# EAGLE schematic Hive 0.99 (EAGLE 9.6.2)
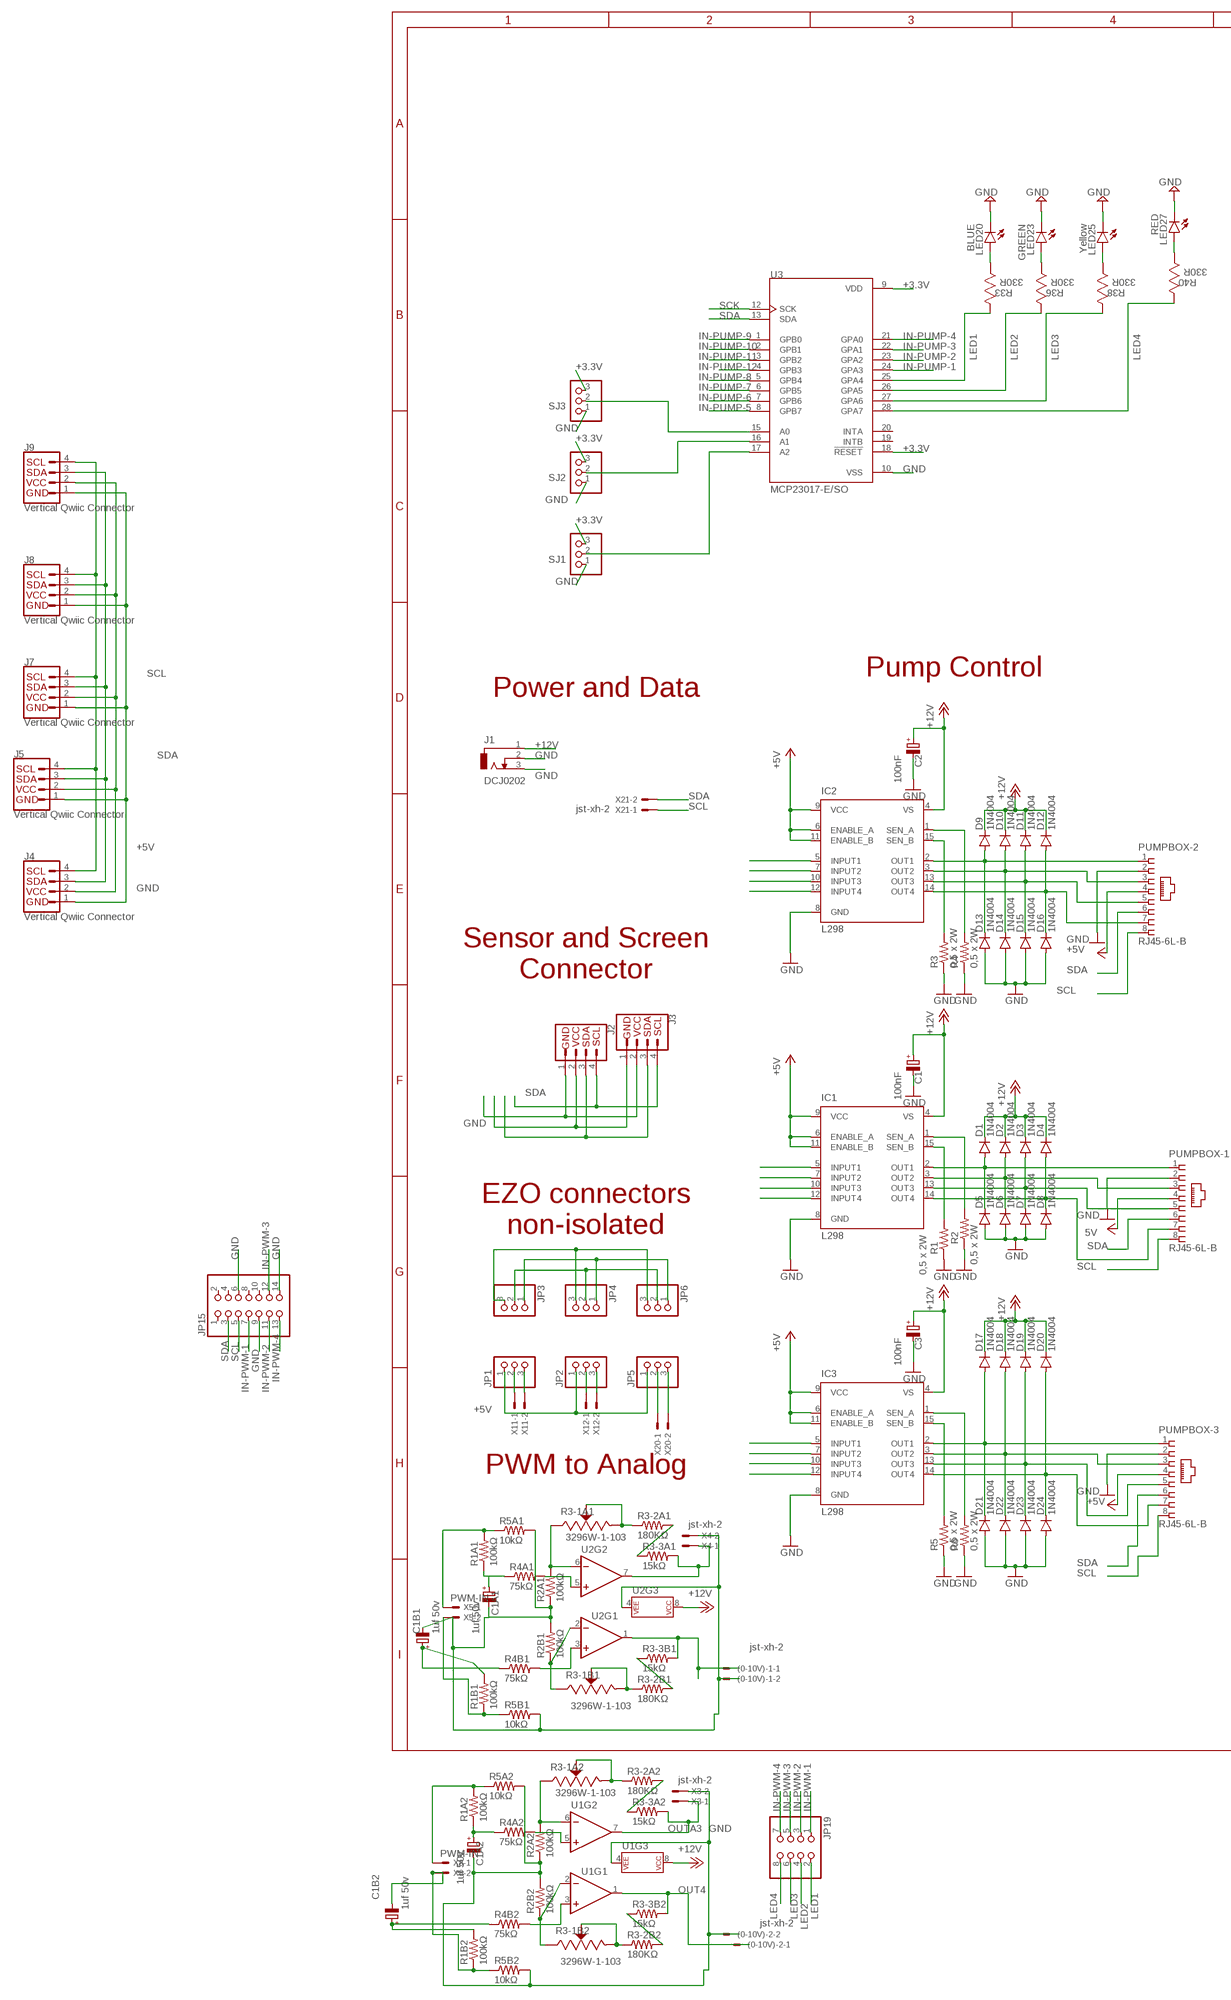
[diagram p0: schematic, sheet 1, part 1 of 2]
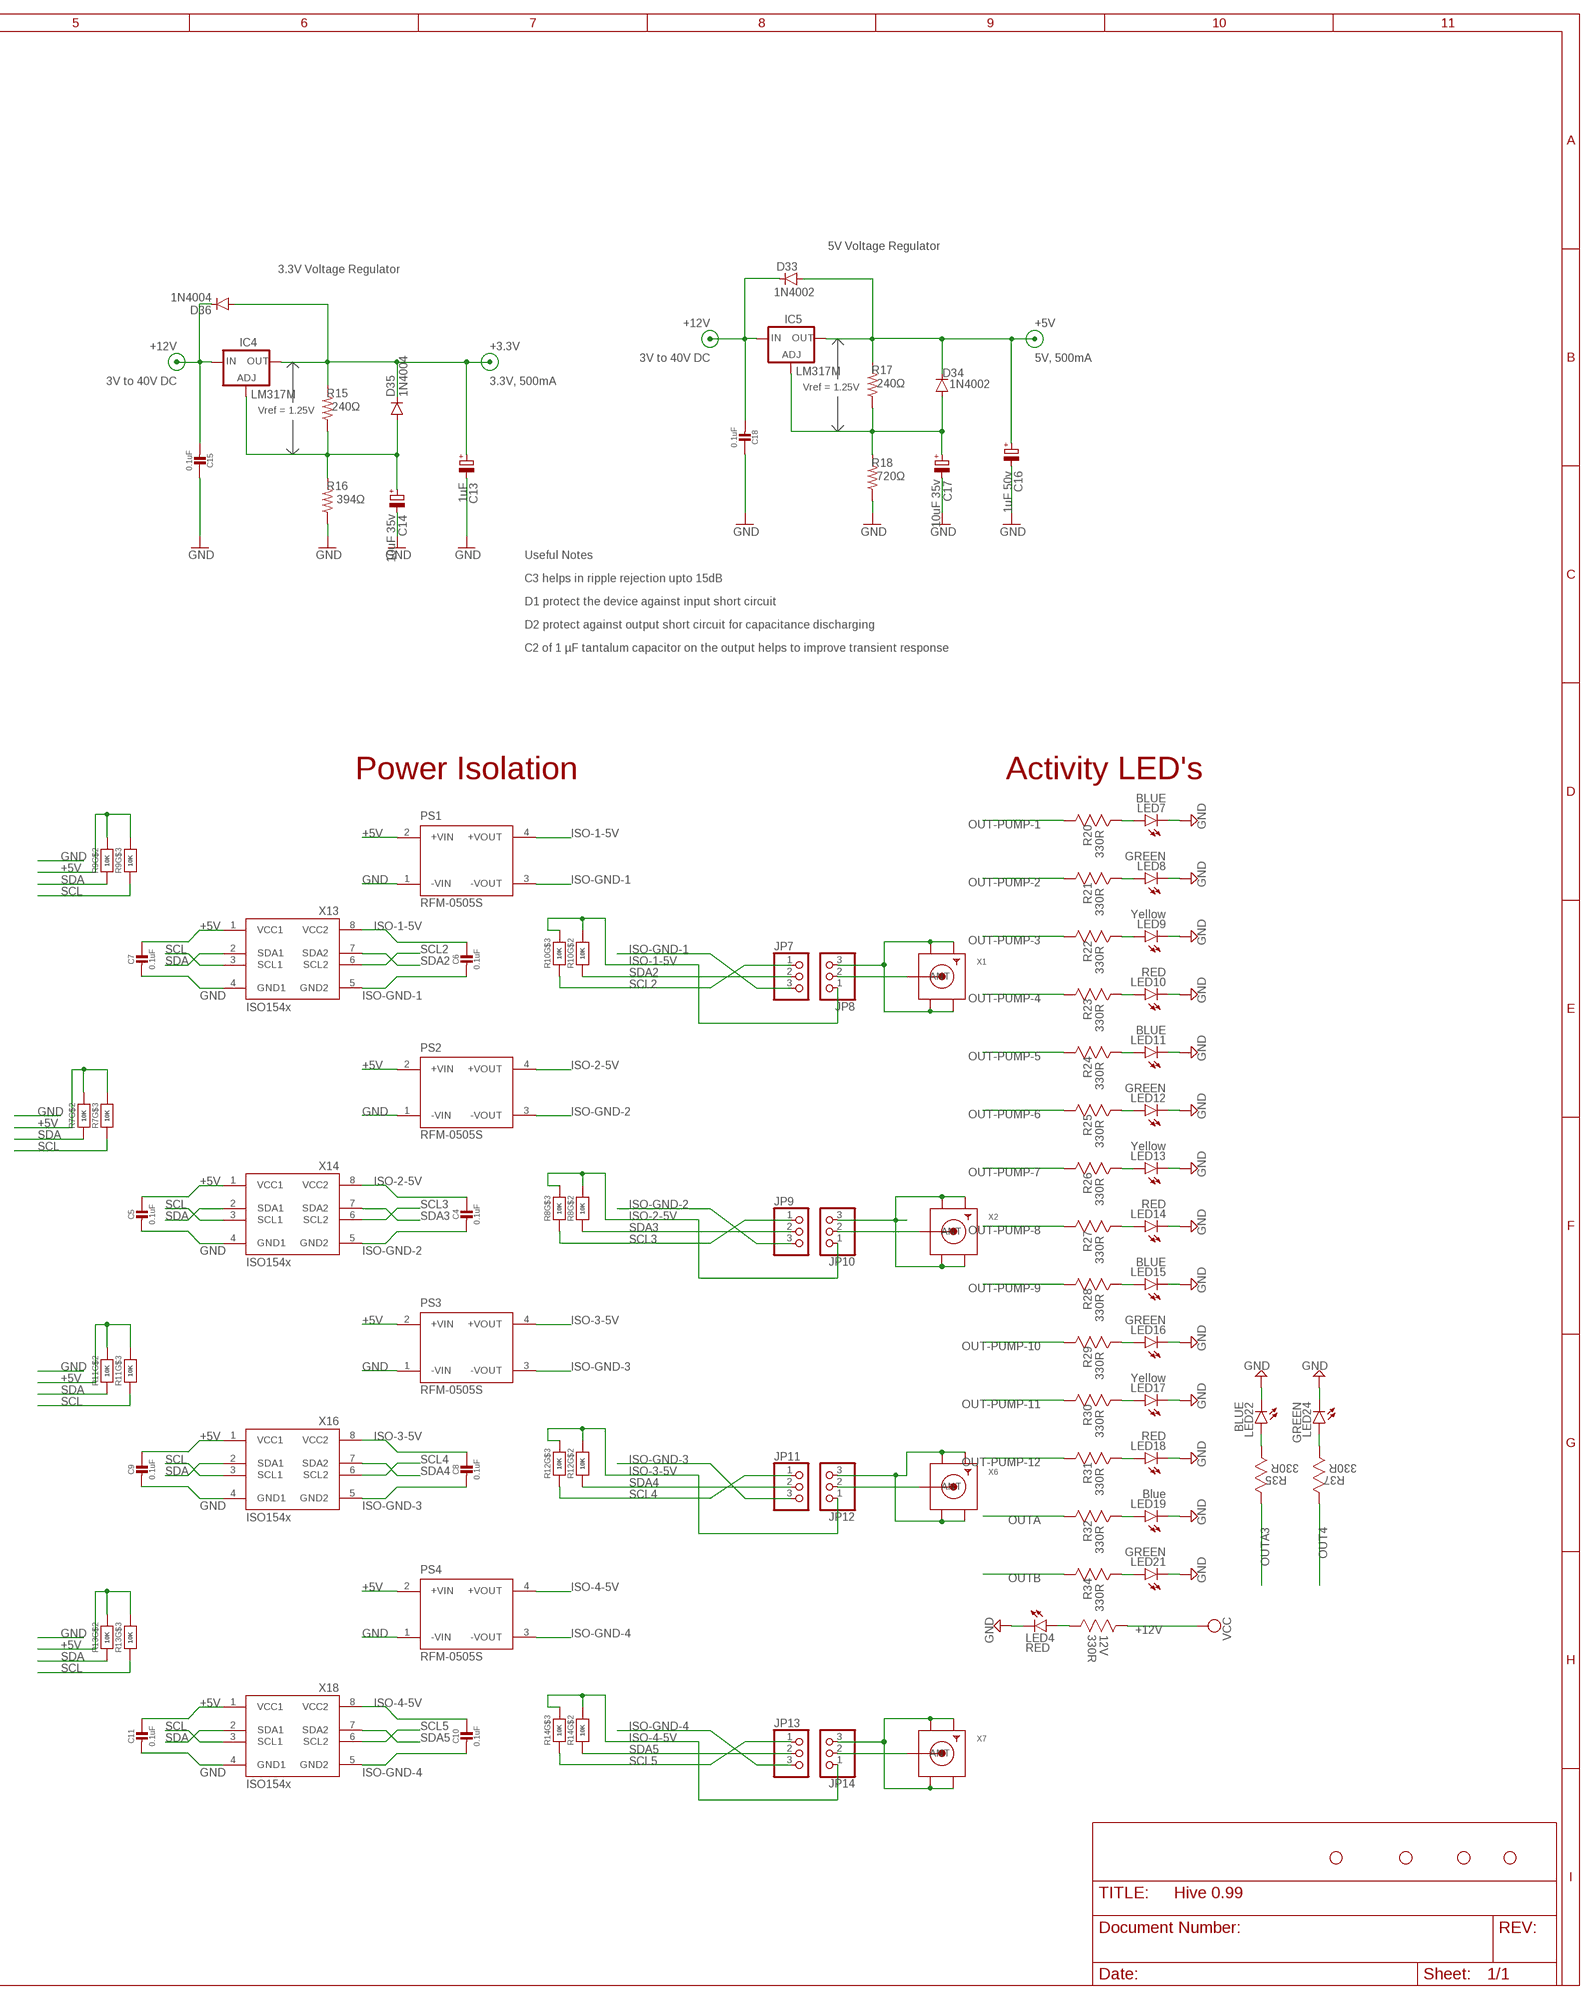
[diagram p1: schematic, sheet 1, part 2 of 2]

## Parts
12V  330R  MC0.063W06031%330R  [RESC1608X60N]
(0-10V)-1  jst-xh-2  JST-XH-02-PIN-LONG-PAD  [JST-XH-02-PACKAGE-LONG-PAD]
(0-10V)-2  jst-xh-2  JST-XH-02-PIN-LONG-PAD  [JST-XH-02-PACKAGE-LONG-PAD]
C1  100nF  1U/50V  [E1,5-4]
C1A1  1uf 50v  1U/50V  [E1,5-4]
C1A2  1uf 50v  1U/50V  [E1,5-4]
C1B1  1uf 50v  1U/50V  [E1,5-4]
C1B2  1uf 50v  1U/50V  [E1,5-4]
C2  100nF  1U/50V  [E1,5-4]
C3  100nF  1U/50V  [E1,5-4]
C4  0.1uF  CAP_CERAMIC0603_NO  [0603-NO]
C5  0.1uF  CAP_CERAMIC0603_NO  [0603-NO]
C6  0.1uF  CAP_CERAMIC0603_NO  [0603-NO]
C7  0.1uF  CAP_CERAMIC0603_NO  [0603-NO]
C8  0.1uF  CAP_CERAMIC0603_NO  [0603-NO]
C9  0.1uF  CAP_CERAMIC0603_NO  [0603-NO]
C10  0.1uF  CAP_CERAMIC0603_NO  [0603-NO]
C11  0.1uF  CAP_CERAMIC0603_NO  [0603-NO]
C13  1uF  1U/50V  [E1,5-4]
C14  10uF 35v  1U/50V  [E1,5-4]
C15  0.1uF  CAP_CERAMIC0603_NO  [0603-NO]
C16  1uF 50v  1U/50V  [E1,5-4]
C17  10uF 35v  1U/50V  [E1,5-4]
C18  0.1uF  CAP_CERAMIC0603_NO  [0603-NO]
D1  1N4004  DIODE-DO214BA  [DO214BA]
D2  1N4004  DIODE-DO214BA  [DO214BA]
D3  1N4004  DIODE-DO214BA  [DO214BA]
D4  1N4004  DIODE-DO214BA  [DO214BA]
D5  1N4004  DIODE-DO214BA  [DO214BA]
D6  1N4004  DIODE-DO214BA  [DO214BA]
D7  1N4004  DIODE-DO214BA  [DO214BA]
D8  1N4004  DIODE-DO214BA  [DO214BA]
D9  1N4004  DIODE-DO214BA  [DO214BA]
D10  1N4004  DIODE-DO214BA  [DO214BA]
D11  1N4004  DIODE-DO214BA  [DO214BA]
D12  1N4004  DIODE-DO214BA  [DO214BA]
D13  1N4004  DIODE-DO214BA  [DO214BA]
D14  1N4004  DIODE-DO214BA  [DO214BA]
D15  1N4004  DIODE-DO214BA  [DO214BA]
D16  1N4004  DIODE-DO214BA  [DO214BA]
D17  1N4004  DIODE-DO214BA  [DO214BA]
D18  1N4004  DIODE-DO214BA  [DO214BA]
D19  1N4004  DIODE-DO214BA  [DO214BA]
D20  1N4004  DIODE-DO214BA  [DO214BA]
D21  1N4004  DIODE-DO214BA  [DO214BA]
D22  1N4004  DIODE-DO214BA  [DO214BA]
D23  1N4004  DIODE-DO214BA  [DO214BA]
D24  1N4004  DIODE-DO214BA  [DO214BA]
D33  1N4002  DIODE-DO214BA  [DO214BA]
D34  1N4002  DIODE-DO214BA  [DO214BA]
D35  1N4004  DIODE-DO214BA  [DO214BA]
D36  1N4004  DIODE-DO214BA  [DO214BA]
H5  STAND-OFF  [STAND-OFF]
H6  STAND-OFF  [STAND-OFF]
H7  STAND-OFF  [STAND-OFF]
H8  STAND-OFF  [STAND-OFF]
IC1  L298  [MULTIWATT-15]
IC2  L298  [MULTIWATT-15]
IC3  L298  [MULTIWATT-15]
IC4  LM317MBSTT3  [SOT223]
IC5  LM317MBSTT3  [SOT223]
J1  DCJ0202  [DCJ0202]
J2  I2C_STANDARD  [1X04]
J3  I2C_STANDARD  [1X04]
J4  Vertical Qwiic Connector  QWIIC_CONNECTOR  [JST04_1MM_VERT]
J5  Vertical Qwiic Connector  QWIIC_CONNECTOR  [JST04_1MM_VERT]
J7  Vertical Qwiic Connector  QWIIC_CONNECTOR  [JST04_1MM_VERT]
J8  Vertical Qwiic Connector  QWIIC_CONNECTOR  [JST04_1MM_VERT]
J9  Vertical Qwiic Connector  QWIIC_CONNECTOR  [JST04_1MM_VERT]
JP1  PINHD-1X3CB  [1X03-CLEANBIG]
JP2  PINHD-1X3CB  [1X03-CLEANBIG]
JP3  PINHD-1X3CB  [1X03-CLEANBIG]
JP4  PINHD-1X3CB  [1X03-CLEANBIG]
JP5  PINHD-1X3CB  [1X03-CLEANBIG]
JP6  PINHD-1X3CB  [1X03-CLEANBIG]
JP7  PINHD-1X3CB  [1X03-CLEANBIG]
JP8  PINHD-1X3CB  [1X03-CLEANBIG]
JP9  PINHD-1X3CB  [1X03-CLEANBIG]
JP10  PINHD-1X3CB  [1X03-CLEANBIG]
JP11  PINHD-1X3CB  [1X03-CLEANBIG]
JP12  PINHD-1X3CB  [1X03-CLEANBIG]
JP13  PINHD-1X3CB  [1X03-CLEANBIG]
JP14  PINHD-1X3CB  [1X03-CLEANBIG]
JP15  PINHD-2X7  [2X07]
JP19  PINHD-2X4  [2X04]
LED4  RED  LED-RED1206  [LED-1206]
LED7  BLUE  LED-BLUE0603  [LED-0603]
LED8  GREEN  LED-GREEN0603  [LED-0603]
LED9  Yellow  LED-YELLOW-0603-WE  [LED-0603]
LED10  RED  LED-RED0603  [LED-0603]
LED11  BLUE  LED-BLUE0603  [LED-0603]
LED12  GREEN  LED-GREEN0603  [LED-0603]
LED13  Yellow  LED-YELLOW0603  [LED-0603]
LED14  RED  LED-RED0603  [LED-0603]
LED15  BLUE  LED-BLUE0603  [LED-0603]
LED16  GREEN  LED-GREEN0603  [LED-0603]
LED17  Yellow  LED-YELLOW0603  [LED-0603]
LED18  RED  LED-RED0603  [LED-0603]
LED19  Blue  LED-BLUE-0603-WE  [LED-0603]
LED20  BLUE  LED-BLUE0603  [LED-0603]
LED21  GREEN  LED-GREEN0603  [LED-0603]
LED22  BLUE  LED-BLUE0603  [LED-0603]
LED23  GREEN  LED-GREEN0603  [LED-0603]
LED24  GREEN  LED-GREEN0603  [LED-0603]
LED25  Yellow  LED-YELLOW0603  [LED-0603]
LED27  RED  LED-RED0603  [LED-0603]
PS1  RFM-0505S  [CONV_RFM-0505S]
PS2  RFM-0505S  [CONV_RFM-0505S]
PS3  RFM-0505S  [CONV_RFM-0505S]
PS4  RFM-0505S  [CONV_RFM-0505S]
PUMPBOX-1  RJ45-6L-B  [RJ45-NO-SHIELD]
PUMPBOX-2  RJ45-6L-B  [RJ45-NO-SHIELD]
PUMPBOX-3  RJ45-6L-B  [RJ45-NO-SHIELD]
R1  0,5 x 2W  R-US_R2512  [R2512]
R1A1  100kΩ  R-US_M1206  [M1206]
R1A2  100kΩ  R-US_M1206  [M1206]
R1B1  100kΩ  R-US_M1206  [M1206]
R1B2  100kΩ  R-US_M1206  [M1206]
R2  0,5 x 2W  R-US_R2512  [R2512]
R2A1  100kΩ  R-US_M1206  [M1206]
R2A2  100kΩ  R-US_M1206  [M1206]
R2B1  100kΩ  R-US_M1206  [M1206]
R2B2  100kΩ  R-US_M1206  [M1206]
R3  0,5 x 2W  R-US_R2512  [R2512]
R3-1A1  3296W-1-103  [TRIM_3296W-1-103]
R3-1A2  3296W-1-103  [TRIM_3296W-1-103]
R3-1B1  3296W-1-103  [TRIM_3296W-1-103]
R3-1B2  3296W-1-103  [TRIM_3296W-1-103]
R3-2A1  180KΩ  R-US_M1206  [M1206]
R3-2A2  180KΩ  R-US_M1206  [M1206]
R3-2B1  180KΩ  R-US_M1206  [M1206]
R3-2B2  180KΩ  R-US_M1206  [M1206]
R3-3A1  15kΩ  R-US_M1206  [M1206]
R3-3A2  15kΩ  R-US_M1206  [M1206]
R3-3B1  15kΩ  R-US_M1206  [M1206]
R3-3B2  15kΩ  R-US_M1206  [M1206]
R4  0,5 x 2W  R-US_R2512  [R2512]
R4A1  75kΩ  R-US_M1206  [M1206]
R4A2  75kΩ  R-US_M1206  [M1206]
R4B1  75kΩ  R-US_M1206  [M1206]
R4B2  75kΩ  R-US_M1206  [M1206]
R5  0,5 x 2W  R-US_R2512  [R2512]
R5A1  10kΩ  R-US_M1206  [M1206]
R5A2  10kΩ  R-US_M1206  [M1206]
R5B1  10kΩ  R-US_M1206  [M1206]
R5B2  10kΩ  R-US_M1206  [M1206]
R6  0,5 x 2W  R-US_R2512  [R2512]
R7  10K  RESISTOR_4PACK  [RESPACK_4X0603]
R8  10K  RESISTOR_4PACK  [RESPACK_4X0603]
R9  10K  RESISTOR_4PACK  [RESPACK_4X0603]
R10  10K  RESISTOR_4PACK  [RESPACK_4X0603]
R11  10K  RESISTOR_4PACK  [RESPACK_4X0603]
R12  10K  RESISTOR_4PACK  [RESPACK_4X0603]
R13  10K  RESISTOR_4PACK  [RESPACK_4X0603]
R14  10K  RESISTOR_4PACK  [RESPACK_4X0603]
R15  240Ω  R-US_M0805  [M0805]
R16  394Ω  R-US_M0805  [M0805]
R17  240Ω  R-US_M0805  [M0805]
R18  720Ω  R-US_M0805  [M0805]
R20  330R  MC0.063W06031%330R  [RESC1608X60N]
R21  330R  MC0.063W06031%330R  [RESC1608X60N]
R22  330R  MC0.063W06031%330R  [RESC1608X60N]
R23  330R  MC0.063W06031%330R  [RESC1608X60N]
R24  330R  MC0.063W06031%330R  [RESC1608X60N]
R25  330R  MC0.063W06031%330R  [RESC1608X60N]
R26  330R  MC0.063W06031%330R  [RESC1608X60N]
R27  330R  MC0.063W06031%330R  [RESC1608X60N]
R28  330R  MC0.063W06031%330R  [RESC1608X60N]
R29  330R  MC0.063W06031%330R  [RESC1608X60N]
R30  330R  MC0.063W06031%330R  [RESC1608X60N]
R31  330R  MC0.063W06031%330R  [RESC1608X60N]
R32  330R  MC0.063W06031%330R  [RESC1608X60N]
R33  330R  MC0.063W06031%330R  [RESC1608X60N]
R34  330R  MC0.063W06031%330R  [RESC1608X60N]
R35  330R  MC0.063W06031%330R  [RESC1608X60N]
R36  330R  MC0.063W06031%330R  [RESC1608X60N]
R37  330R  MC0.063W06031%330R  [RESC1608X60N]
R38  330R  MC0.063W06031%330R  [RESC1608X60N]
R40  330R  MC0.063W06031%330R  [RESC1608X60N]
SJ1  PINHD-1X3  [1X03]
SJ2  PINHD-1X3  [1X03]
SJ3  PINHD-1X3  [1X03]
U1  LM358  LM358SOI8  [SO08]
U2  LM358  LM358SOI8  [SO08]
U3  MCP23017-E/SO  [SOIC127P1030X265-28N]
X1  SMACONNECTOR_EDGE  [SMA_EDGELAUNCH]
X2  SMACONNECTOR_EDGE  [SMA_EDGELAUNCH]
X3  jst-xh-2  JST-XH-02-PIN-LONG-PAD  [JST-XH-02-PACKAGE-LONG-PAD]
X4  jst-xh-2  JST-XH-02-PIN-LONG-PAD  [JST-XH-02-PACKAGE-LONG-PAD]
X5  PWM-IN  JST-XH-02-PIN-LONG-PAD  [JST-XH-02-PACKAGE-LONG-PAD]
X6  SMACONNECTOR_EDGE  [SMA_EDGELAUNCH]
X7  SMACONNECTOR_EDGE  [SMA_EDGELAUNCH]
X8  PWM-IN  JST-XH-02-PIN-LONG-PAD  [JST-XH-02-PACKAGE-LONG-PAD]
X11  jst-xh-2  JST-XH-02-PIN-LONG-PAD  [JST-XH-02-PACKAGE-LONG-PAD]
X12  jst-xh-2  JST-XH-02-PIN-LONG-PAD  [JST-XH-02-PACKAGE-LONG-PAD]
X13  ISO154X  [SOIC8_150MIL]
X14  ISO154X  [SOIC8_150MIL]
X16  ISO154X  [SOIC8_150MIL]
X18  ISO154X  [SOIC8_150MIL]
X20  jst-xh-2  JST-XH-02-PIN-LONG-PAD  [JST-XH-02-PACKAGE-LONG-PAD]
X21  jst-xh-2  JST-XH-02-PIN-LONG-PAD  [JST-XH-02-PACKAGE-LONG-PAD]

## Nets
+3.3V [3.3v]: C13.+ D35.C D36.A IC4.4(OUT) R15.2 SJ1.3 SJ2.3 SJ3.3 U3.9(VDD) U3.18(!RESET)
+5V [5v]: C5.1 C7.1 C9.1 C11.1 C16.+ D33.A D34.C IC1.6(ENABLE_A) IC1.9(VCC) IC1.11(ENABLE_B) IC2.6(ENABLE_A) IC2.9(VCC) IC2.11(ENABLE_B) IC3.6(ENABLE_A) IC3.9(VCC) IC3.11(ENABLE_B) IC5.4(OUT) J2.1 J3.2 J4.2 J5.2 J7.2 J8.2 J9.2 JP1.1 JP2.1 JP5.1 PS1.2(+VIN) PS2.2(+VIN) PS3.2(+VIN) PS4.2(+VIN) PUMPBOX-1.4 PUMPBOX-2.4 PUMPBOX-3.4 R7.6 R7.7 R9.6 R9.7 R11.6 R11.7 R13.6 R13.7 R17.2 X13.1(VCC1) X14.1(VCC1) X16.1(VCC1) X18.1(VCC1) ; supply symbol labelled +3V3
+12V [12v]: 12V.1(R1) C1.+ C2.+ C3.+ C15.2 C18.2 D1.C D2.C D3.C D4.C D9.C D10.C D11.C D12.C D17.C D18.C D19.C D20.C D33.C D36.C IC1.4(VS) IC2.4(VS) IC3.4(VS) IC4.3(IN) IC5.3(IN) J1.1 U1.8(P$V+) U2.8(P$V+) ; supply symbol labelled VCC
GND: (0-10V)-1.2 (0-10V)-2.2 C1.- C1A1.- C1A2.- C1B1.- C2.- C3.- C5.2 C7.2 C9.2 C11.2 C13.- C14.- C15.1 C16.- C17.- C18.1 D5.A D6.A D7.A D8.A D13.A D14.A D15.A D16.A D21.A D22.A D23.A D24.A IC1.8(GND) IC2.8(GND) IC3.8(GND) J1.2 J1.3 J2.2 J3.1 J4.1 J5.1 J7.1 J8.1 J9.1 JP3.3 JP4.3 JP6.3 JP15.6 JP15.9 JP15.14 LED4.C LED7.C LED8.C LED9.C LED10.C LED11.C LED12.C LED13.C LED14.C LED15.C LED16.C LED17.C LED18.C LED19.C LED20.C LED21.C LED22.C LED23.C LED24.C LED25.C LED27.C PS1.1(-VIN) PS2.1(-VIN) PS3.1(-VIN) PS4.1(-VIN) PUMPBOX-1.2 PUMPBOX-2.2 PUMPBOX-3.2 R1.1 R2.1 R2A1.1 R2A2.1 R2B1.2 R2B2.2 R3.1 R4.1 R5.1 R5A1.2 R5A2.2 R5B1.2 R5B2.2 R6.1 R16.1 R18.1 SJ1.1 SJ2.1 SJ3.1 U1.4(P$V-) U2.4(P$V-) U3.10(VSS) X3.2 X4.2 X13.4(GND1) X14.4(GND1) X16.4(GND1) X18.4(GND1)
IN-PUMP-1: IC1.5(INPUT1) U3.24(GPA3)
IN-PUMP-2: IC1.7(INPUT2) U3.23(GPA2)
IN-PUMP-3: IC1.10(INPUT3) U3.22(GPA1)
IN-PUMP-4: IC1.12(INPUT4) U3.21(GPA0)
IN-PUMP-5 [GPIO]: IC2.5(INPUT1) U3.8(GPB7)
IN-PUMP-6 [GPIO]: IC2.7(INPUT2) U3.7(GPB6)
IN-PUMP-7 [GPIO]: IC2.10(INPUT3) U3.6(GPB5)
IN-PUMP-8 [GPIO]: IC2.12(INPUT4) U3.5(GPB4)
IN-PUMP-9 [GPIO]: IC3.5(INPUT1) U3.1(GPB0)
IN-PUMP-10 [GPIO]: IC3.7(INPUT2) U3.2(GPB1)
IN-PUMP-11 [GPIO]: IC3.10(INPUT3) U3.3(GPB2)
IN-PUMP-12 [GPIO]: IC3.12(INPUT4) U3.4(GPB3)
IN-PWM-1: JP15.7 JP19.1 R1A1.2 R5A1.1 X5.1
IN-PWM-2: JP15.11 JP19.3 R1B1.1 R5B1.1 X5.2
IN-PWM-3: JP15.12 JP19.5 R1A2.2 R5A2.1 X8.1
IN-PWM-4: C1B2.- JP15.13 JP19.7 R1B2.1 R5B2.1 X8.2
ISO-1-5V: C6.1 JP8.1 PS1.4(+VOUT) R10.6 R10.7 X13.8(VCC2)
ISO-2-5V: C4.1 JP10.1 PS2.4(+VOUT) R8.6 R8.7 X14.8(VCC2)
ISO-3-5V: C8.1 JP12.1 PS3.4(+VOUT) R12.6 R12.7 X16.8(VCC2)
ISO-4-5V: C10.1 JP14.1 PS4.4(+VOUT) R14.6 R14.7 X18.8(VCC2)
ISO-GND-1: C6.2 JP7.3 PS1.3(-VOUT) X13.5(GND2)
ISO-GND-2: C4.2 JP9.3 PS2.3(-VOUT) X14.5(GND2)
ISO-GND-3: C8.2 JP11.3 PS3.3(-VOUT) X16.5(GND2)
ISO-GND-4: C10.2 JP13.3 PS4.3(-VOUT) X18.5(GND2)
LED1: JP19.2 R33.1(R1) U3.25(GPA4)
LED2: JP19.4 R36.1(R1) U3.26(GPA5)
LED3: JP19.6 R38.1(R1) U3.27(GPA6)
LED4: JP19.8 R40.1(R1) U3.28(GPA7)
N$1: IC2.1(SEN_A) R4.2
N$2: IC2.15(SEN_B) R3.2
N$3: IC3.1(SEN_A) R6.2
N$4: IC3.15(SEN_B) R5.2
N$5: C14.+ D35.A IC4.1(ADJ) R15.1 R16.2
N$6: R3-1B2.2(WIPER) R3-1B2.3(CW) R3-2B2.1
N$7: LED20.A R33.2(R2)
N$8: R3-2B2.2 R3-3B2.1
N$9: IC1.1(SEN_A) R2.2
N$10: IC1.15(SEN_B) R1.2
N$11: C17.+ D34.A IC5.1(ADJ) R17.1 R18.2
N$12: JP12.3 X6.GND@1(GND4) X6.GND@2(GND3) X6.GND@3(GND2) X6.GND@4(GND1)
N$13: LED23.A R36.2(R2)
N$14: JP8.3 X1.GND@1(GND4) X1.GND@2(GND3) X1.GND@3(GND2) X1.GND@4(GND1)
N$15: JP10.3 X2.GND@1(GND4) X2.GND@2(GND3) X2.GND@3(GND2) X2.GND@4(GND1)
N$16: JP8.2 X1.P(ANT)
N$17: R3-1B1.2(WIPER) R3-1B1.3(CW) R3-2B1.1
N$18: R3-2B1.2 R3-3B1.1
N$19: R3-1A1.2(WIPER) R3-1A1.3(CW) R3-2A1.1
N$20: R3-2A1.2 R3-3A1.1
N$21: C1A1.+ R1A1.1 R4A1.1
N$22: C1B1.+ R1B1.2 R4B1.1
N$23: R2A1.2 R3-1A1.1(CCW) U2.6(-IN)
N$24: R2B1.1 R3-1B1.1(CCW) U2.2(-IN)
N$25: R4A1.2 U2.5(+IN)
N$26: R4B1.2 U2.3(+IN)
N$27: C1B2.+ R1B2.2 R4B2.1
N$28: LED22.A R35.2(R2)
N$29: LED24.A R37.2(R2)
N$30: JP14.3 X7.GND@1(GND4) X7.GND@2(GND3) X7.GND@3(GND2) X7.GND@4(GND1)
N$31: JP5.2 X20.1
N$32: JP10.2 X2.P(ANT)
N$33: JP5.3 X20.2
N$34: JP2.2 X12.1
N$35: JP2.3 X12.2
N$36: JP12.2 X6.P(ANT)
N$37: JP1.2 X11.1
N$38: JP1.3 X11.2
N$40: JP14.2 X7.P(ANT)
N$47: 12V.2(R2) LED4.A
N$50 [GPIO]: LED7.A R20.2(R2)
N$51 [GPIO]: LED8.A R21.2(R2)
N$52 [GPIO]: LED9.A R22.2(R2)
N$53 [GPIO]: LED10.A R23.2(R2)
N$54 [GPIO]: LED11.A R24.2(R2)
N$55 [GPIO]: LED12.A R25.2(R2)
N$56 [GPIO]: LED13.A R26.2(R2)
N$57 [GPIO]: LED14.A R27.2(R2)
N$58 [GPIO]: LED15.A R28.2(R2)
N$59 [GPIO]: LED16.A R29.2(R2)
N$60 [GPIO]: LED17.A R30.2(R2)
N$61 [GPIO]: LED18.A R31.2(R2)
N$62 [GPIO]: LED19.A R32.2(R2)
N$63: R3-1A2.2(WIPER) R3-1A2.3(CW) R3-2A2.1
N$64 [GPIO]: LED21.A R34.2(R2)
N$65: LED25.A R38.2(R2)
N$66: R3-2A2.2 R3-3A2.1
N$67: LED27.A R40.2(R2)
N$68: C1A2.+ R1A2.1 R4A2.1
N$70: R2A2.2 R3-1A2.1(CCW) U1.6(-IN)
N$71: R2B2.1 R3-1B2.1(CCW) U1.2(-IN)
N$72: R4A2.2 U1.5(+IN)
N$73: R4B2.2 U1.3(+IN)
N$74: SJ3.2 U3.15(A0)
N$75: SJ2.2 U3.16(A1)
N$76: SJ1.2 U3.17(A2)
OUT4: (0-10V)-2.1 R3-3B2.2 R37.1(R1) U1.1(OUT)
OUT-PUMP-1 [Pump Out]: D1.A D5.C IC1.2(OUT1) PUMPBOX-1.1 R20.1(R1)
OUT-PUMP-2 [Pump Out]: D2.A D6.C IC1.3(OUT2) PUMPBOX-1.3 R21.1(R1)
OUT-PUMP-3 [Pump Out]: D3.A D7.C IC1.13(OUT3) PUMPBOX-1.5 R22.1(R1)
OUT-PUMP-4 [Pump Out]: D4.A D8.C IC1.14(OUT4) PUMPBOX-1.7 R23.1(R1)
OUT-PUMP-5 [Pump Out]: D9.A D13.C IC2.2(OUT1) PUMPBOX-2.1 R24.1(R1)
OUT-PUMP-6 [Pump Out]: D10.A D14.C IC2.3(OUT2) PUMPBOX-2.3 R25.1(R1)
OUT-PUMP-7 [Pump Out]: D11.A D15.C IC2.13(OUT3) PUMPBOX-2.5 R26.1(R1)
OUT-PUMP-8 [Pump Out]: D12.A D16.C IC2.14(OUT4) PUMPBOX-2.7 R27.1(R1)
OUT-PUMP-9 [Pump Out]: D17.A D21.C IC3.2(OUT1) PUMPBOX-3.1 R28.1(R1)
OUT-PUMP-10 [Pump Out]: D18.A D22.C IC3.3(OUT2) PUMPBOX-3.3 R29.1(R1)
OUT-PUMP-11 [Pump Out]: D19.A D23.C IC3.13(OUT3) PUMPBOX-3.5 R30.1(R1)
OUT-PUMP-12: D20.A D24.C IC3.14(OUT4) PUMPBOX-3.7 R31.1(R1)
OUTA: R3-3A1.2 R32.1(R1) U2.7(OUT) X4.1
OUTA3: R3-3A2.2 R35.1(R1) U1.7(OUT) X3.1
OUTB: (0-10V)-1.1 R3-3B1.2 R34.1(R1) U2.1(OUT)
SCK: U3.12(SCK)
SCL: J2.3 J3.3 J4.4 J5.4 J7.4 J8.4 J9.4 JP3.1 JP4.1 JP6.1 JP15.5 PUMPBOX-1.8 PUMPBOX-2.8 PUMPBOX-3.8 R7.3 R9.3 R11.3 R13.3 X13.3(SCL1) X14.3(SCL1) X16.3(SCL1) X18.3(SCL1) X21.1
SCL2: JP7.1 R10.3 X13.6(SCL2)
SCL3: JP9.1 R8.3 X14.6(SCL2)
SCL4: JP11.1 R12.3 X16.6(SCL2)
SCL5: JP13.1 R14.3 X18.6(SCL2)
SDA: J2.4 J3.4 J4.3 J5.3 J7.3 J8.3 J9.3 JP3.2 JP4.2 JP6.2 JP15.3 PUMPBOX-1.6 PUMPBOX-2.6 PUMPBOX-3.6 R7.2 R9.2 R11.2 R13.2 U3.13(SDA) X13.2(SDA1) X14.2(SDA1) X16.2(SDA1) X18.2(SDA1) X21.2
SDA2: JP7.2 R10.2 X13.7(SDA2)
SDA3: JP9.2 R8.2 X14.7(SDA2)
SDA4: JP11.2 R12.2 X16.7(SDA2)
SDA5: JP13.2 R14.2 X18.7(SDA2)
Unconnected: JP15.1 JP15.2 JP15.4 JP15.8 JP15.10 R7.1 R7.4 R7.5 R7.8 R8.1 R8.4 R8.5 R8.8 R9.1 R9.4 R9.5 R9.8 R10.1 R10.4 R10.5 R10.8 R11.1 R11.4 R11.5 R11.8 R12.1 R12.4 R12.5 R12.8 R13.1 R13.4 R13.5 R13.8 R14.1 R14.4 R14.5 R14.8 U3.19(INTB) U3.20(INTA)

## Notes on the sheet
- 5V Voltage Regulator
- 3.3V Voltage Regulator
- 3V to 40V DC | 5V, 500mA
- 3V to 40V DC | 3.3V, 500mA
- Vref = 1.25V
- Vref = 1.25V
- Useful Notes
- C3 helps in ripple rejection upto 15dB
- D1 protect the device against input short circuit
- D2 protect against output short circuit for capacitance discharging
- C2 of 1 µF tantalum capacitor on the output helps to improve transient response
- Pump Control
- Power Isolation | Activity LED's
- Power and Data
- Sensor and Screen
  Connector
- EZO connectors
  non-isolated
- PWM to Analog

## Library data of the parts
12V R20-R38 R40 = Multicomp:MC0.063W06031%330R: RESISTOR, 0603; MPN: MC0.063W06031%330R; OC_FARNELL: 9331018; OC_NEWARK: -; SUPPLIER: Multicomp; TOLERANCE: ±1%; VALUE: 330 Ohms; WATTAGE: 1/16 W
(0-10V)-1 (0-10V)-2 X3-X5 X8 X11 X12 X20 X21 = Rembrandt Electronics - JST XH Connectors v1-0:JST-XH-02-PIN: JST XH Connector 2 Pin Wire to board connector. Pitch: 2,54 mm, (0.100") Number of pins: 2 Created by Rembrandt Electronics www.rembrandtelectronics.com
C1 C1A1 C1A2 C1B1 C1B2 C2 C3 C13 C14 C16 C17 = capacitors-electrolytic:?; MOUSER: 647-USW1H010MDD
C4-C11 C15 C18 = microbuilder:CAP_CERAMIC: Ceramic Capacitors For new designs, use the packages preceded by an '_' character since they are more reliable: The following footprints should be used on most boards: _0402 - Standard footprint for regular board layouts _0603 - Standard footprint for regular board layouts _0805 - Standard footprint for regular board layouts _1206 - Standard footprint for regular board layouts For extremely tight-pitch boards where space is at a premium, the following 'micro-pitch' footprints can be used (smaller pads, no silkscreen outline, etc.): _0402MP - Micro-pitch footprint for very dense/compact boards _0603MP - Micro-pitch footprint for very dense/compact boards _0805MP - Micro-pitch footprint for very dense/compact boards _1206MP - Micro-pitch footprint for very dense/compact boards
D1-D24 D33-D36 = diode:DIODE-: DIODE
H5-H8 = SparkFun-Hardware:STAND-OFF: Stand Off Drill holes for mechanically mounting via screws, standoffs, etc. Note: Use the keepout ring to avoid running the screw head into surrounding components. Variant Overviews STAND-OFF - Mechanical footprint for a #4 phillips button head screw. STAND-OFF-TIGHT - Mechanical footprint for a #4 phillips button head screw, Example SparkFun Products Screw - Phillips Head (1/4", 4-40, 10 pack) <https://www.sparkfun.com/products/10453> (PRT-10453) Screw - Phillips Head (1/2", 4-40, 10 pack) <https://www.sparkfun.com/products/10452> (PRT-10452) Screw - Phillips Head (3/4", 4-40, 10 pack) <https://www.sparkfun.com/products/10451> (PRT-10451) Screw - Phillips Head (1", 4-40, 10 pack) <https://www.sparkfun.com/products/10450> (PRT-10450)
IC1-IC3 = st-microelectronics:L298: DUAL FULL-BRIDGE DRIVER
IC4 IC5 = v-reg:LM317?*: 500 mA Adjustable Output Positive Voltage Regulator Source: http://www.onsemi.co.jp .. LM317M-D.PDF; PARTNUMBER: LM317M
J1 = con-jack:DCJ0202: DC POWER JACK Source: DCJ0202.pdf; OC_FARNELL: unknown; OC_NEWARK: unknown
J2 J3 = SparkFun-Connectors:I2C_STANDARD: SparkFun I2C Standard Pinout Header SparkFun has standardized on a pinout for all I2C based sensor breakouts. This pinout allows I2C boards to be plugged directly into the headers on Arduino Uno compatible boards, and to be daisy chained easily. Example SparkFun Products: SparkFun Atmospheric Sensor Breakout - BME280 <https://www.sparkfun.com/products/13676> SparkFun Altitude/Pressure Sensor Breakout - MPL3115A2 <https://www.sparkfun.com/products/11084> SparkFun TOF Range Finder Sensor - VL6180 <https://www.sparkfun.com/products/12785>
J4 J5 J7-J9 = SparkFun-Connectors:QWIIC_CONNECTOR: SparkFun I2C Standard Qwiic Connector An SMD 1mm pitch JST connector makes it easy and quick (get it? Qwiic?) to connect I2C devices to each other. The Qwiic system <http://www.sparkfun.com/qwiic> enables fast and solderless connection between popular platforms and various sensors and actuators. We carry 200mm <https://www.sparkfun.com/products/14204>, 100mm <https://www.sparkfun.com/products/14205>, 50mm <https://www.sparkfun.com/products/14206>, and breadboard friendly <https://www.sparkfun.com/products/14207> Qwiic cables. We also offer 10 pcs strips <https://www.sparkfun.com/products/14323> the SMD connectors.; PROD_ID: CONN-14483
JP1-JP14 SJ1-SJ3 = adafruit:PINHD-1X3: PIN HEADER
JP15 = pinhead:PINHD-2X7: PIN HEADER
JP19 = pinhead:PINHD-2X4: PIN HEADER
LED4 = SparkFun-LED:LED-RED: Red SMD LED Used in manufacturing of most products at SparkFun Packages: 0603 - SMD 0603 package [Product Link] <http://docs.avagotech.com/docs/AV02-0551EN> 0603 SMART - SMD 0603 SMART package ( more efficient and expensive)[Product Link] <http://www.osram-os.com/Graphics/XPic2/00077099_0.pdf> 1206 - SMD1206 package [Product Link] <https://www.sparkfun.com/datasheets/DevTools/LilyPad/Q150OVS4.pdff> SparkFun Products: Pro Mini 328 -5V <https://www.sparkfun.com/products/821> RedBoard <https://www.sparkfun.com/products/12757> IOIO-OTG <https://www.sparkfun.com/products/13613>; PROD_ID: DIO-09912
LED7 LED11 LED15 LED20 LED22 = SparkFun-LED:LED-BLUE: Blue SMD LED Used in manufacturing of various products at SparkFun Packages: 0603 - SMD 0603 package [Product Link] <http://www.digikey.com/product-detail/en/SMLE12BC7TT86/511-1589-2-ND/1641808> 1206 - SMD1206 package [Product Link] <http://www.digikey.com/product-detail/en/lite-on-inc/LTST-C150TBKT/160-1643-1-ND/573584> SparkFun Products: ESP8266 Thing-Dev Board <https://www.sparkfun.com/products/13711> RedBoard <https://www.sparkfun.com/products/12757>; PROD_ID: DIO-08575
LED8 LED12 LED16 LED21 LED23 LED24 = SparkFun-LED:LED-GREEN: Green SMD LED Used in manufacturing of various products at SparkFun Packages: 0603 - SMD 0603 package [Product Link] <http://www.futureelectronics.com/en/technologies/semiconductors/optoelectronics/leds/Pages/9894312-LTST-C190GKT.aspx?CrossPart=HSMG-C190&IM=0> LilyPad 1206 - SMD1206 LilyPad package [Product Link] <http://www.futureelectronics.com/en/Technologies/Product.aspx?ProductID=IN150NGHARVATEKCORPORATION2049943&IM=0> 1206 - SMD1206 package [Product Link] <http://www.futureelectronics.com/en/technologies/semiconductors/optoelectronics/leds/Pages/8315665-LTST-C150KGKT.aspx?IM=0> 1206 Bottom Mount -SMD 1206 Bottom Mount [Product Link] <http://www.digikey.com/product-detail/en/lite-on-inc/LTST-C230KGKT/160-1456-1-ND/386854> SparkFun Products: Pro Mini 328 -5V <https://www.sparkfun.com/products/821> RedBoard <https://www.sparkfun.com/products/12757> MP3 Trigger <https://www.sparkfun.com/products/13720> Makey Makey <https://www.sparkfun.com/products/11076>; PROD_ID: DIO-00821
LED9 = SparkFun-LED:LED-YELLOW: Yellow SMD LED Used in manufacturing several products at SparkFun. Packages: 0603 - SMD 0603 package[Product Link] <http://www.kingbrightusa.com/product.asp?catalog_name=LED&product_id=APT1608SYCK> 0603 -SMART - SMART SMD 0603 package (more efficient/more expensive) [Product Link] <http://www.osram-os.com/osram_os/en/products/product-catalog/led-light-emitting-diodes/smartled-0603/ly-l29k/index.jsp> LilyPad - SMD1206 package[Product Datasheet] <https://www.sparkfun.com/datasheets/DevTools/LilyPad/Q150YUS4.pdf> SparkFun Products: Blynk Board <https://www.sparkfun.com/products/13794> IOIO-OTG <https://www.sparkfun.com/products/13613> XBee Explorer Serial <https://www.sparkfun.com/products/13225>; PROD_ID: DIO-16514
LED10 LED14 LED18 LED27 = SparkFun-LED:LED-RED: Red SMD LED Used in manufacturing of most products at SparkFun Packages: 0603 - SMD 0603 package [Product Link] <http://docs.avagotech.com/docs/AV02-0551EN> 0603 SMART - SMD 0603 SMART package ( more efficient and expensive)[Product Link] <http://www.osram-os.com/Graphics/XPic2/00077099_0.pdf> 1206 - SMD1206 package [Product Link] <https://www.sparkfun.com/datasheets/DevTools/LilyPad/Q150OVS4.pdff> SparkFun Products: Pro Mini 328 -5V <https://www.sparkfun.com/products/821> RedBoard <https://www.sparkfun.com/products/12757> IOIO-OTG <https://www.sparkfun.com/products/13613>; PROD_ID: DIO-00819
LED13 LED17 LED25 = SparkFun-LED:LED-YELLOW: Yellow SMD LED Used in manufacturing several products at SparkFun. Packages: 0603 - SMD 0603 package[Product Link] <http://www.kingbrightusa.com/product.asp?catalog_name=LED&product_id=APT1608SYCK> 0603 -SMART - SMART SMD 0603 package (more efficient/more expensive) [Product Link] <http://www.osram-os.com/osram_os/en/products/product-catalog/led-light-emitting-diodes/smartled-0603/ly-l29k/index.jsp> LilyPad - SMD1206 package[Product Datasheet] <https://www.sparkfun.com/datasheets/DevTools/LilyPad/Q150YUS4.pdf> SparkFun Products: Blynk Board <https://www.sparkfun.com/products/13794> IOIO-OTG <https://www.sparkfun.com/products/13613> XBee Explorer Serial <https://www.sparkfun.com/products/13225>; PROD_ID: DIO-09003
LED19 = SparkFun-LED:LED-BLUE: Blue SMD LED Used in manufacturing of various products at SparkFun Packages: 0603 - SMD 0603 package [Product Link] <http://www.digikey.com/product-detail/en/SMLE12BC7TT86/511-1589-2-ND/1641808> 1206 - SMD1206 package [Product Link] <http://www.digikey.com/product-detail/en/lite-on-inc/LTST-C150TBKT/160-1643-1-ND/573584> SparkFun Products: ESP8266 Thing-Dev Board <https://www.sparkfun.com/products/13711> RedBoard <https://www.sparkfun.com/products/12757>; PROD_ID: DIO-16513
PS1-PS4 = RFM-0505S:RFM-0505S: DC/DC Converter, 1 Watt, SIP4, Single Output Check availability <https://pricing.snapeda.com/parts/RFM-0505S/Recom%20Power/view-part?ref=eda>; AVAILABILITY: In Stock; DESCRIPTION: 1W DC/DC-Converter 'ECONOLINE' SIP4 1kV unreg; MF: Recom Power; MP: RFM-0505S; PACKAGE: SIP-4 Recom Power; PRICE: None; PURCHASE-URL: https://pricing.snapeda.com/search/part/RFM-0505S/?ref=eda
PUMPBOX-1-PUMPBOX-3 = con-tycoelectronics:RJ45: CORCOM Modular RJ Jacks No Shield Source: www.tycoelectronics.com .. ENG_DS_1654001_1099_RJ_L_0507.pdf; MPN: RJ45-6L-B; OC_FARNELL: unknown; OC_NEWARK: 16R6090
R1 R1A1 R1A2 R1B1 R1B2 R2 R2A1 R2A2 R2B1 R2B2 R3 R3-2A1 R3-2A2 R3-2B1 R3-2B2 R3-3A1 R3-3A2 R3-3B1 R3-3B2 R4 R4A1 R4A2 R4B1 R4B2 R5 R5A1 R5A2 R5B1 R5B2 R6 = adafruit:R-US_: RESISTOR, American symbol
R3-1A1 R3-1A2 R3-1B1 R3-1B2 = 3296W-1-103:3296W-1-103: Res Cermet Trimmer 500K Ohm 10% 0.5W 25(Elec)Turn 2.19mm (9.53 X 4.83 X 11.55mm) Pin Thru-Hole Tube Check availability <https://pricing.snapeda.com/parts/3296W-1-103/Bourns/view-part?ref=eda>; AVAILABILITY: In Stock; DESCRIPTION: 10 kOhms 0.5W, 1/2W PC Pins Through Hole Trimmer Potentiometer Cermet 25.0 Turn Top Adjustment; MF: Bourns; MP: 3296W-1-103; PACKAGE: SOT-23-5 Bourns; PRICE: None; PURCHASE-URL: https://pricing.snapeda.com/search/part/3296W-1-103/?ref=eda
R7-R14 = microbuilder:RESISTOR_4PACK: Resistor Packs (4 resistors) 4 x 0603 10K 1/16W - Digikey: YC164J-10KCT-ND
R15-R18 = resistor:R-US_: RESISTOR, American symbol
U1 U2 = SparkFun-IC-Amplifiers:LM358: LM358 Jellybean op-amp Datasheet <http://www.sparkfun.com/datasheets/Components/General/LM358.pdf> SparkFun Products Op-Amp (Thru-Hole) - LM358 <https://www.sparkfun.com/products/9456> (COM-09456)
U3 = MCP23017-E_SO:MCP23017-E/SO: MCP23017 Series 5.5 V 1.7 MHz SMT 16-Bit I2C I/O Expander - SOIC-28 Check availability <https://pricing.snapeda.com/parts/MCP23017-E/SO/Microchip/view-part?ref=eda>; AVAILABILITY: In Stock; DESCRIPTION: I/O Expander 16 I²C 1.7 MHz 28-SOIC; MF: Microchip; MP: MCP23017-E/SO; PACKAGE: SOIC-28 Microchip; PRICE: None; PURCHASE-URL: https://pricing.snapeda.com/search/part/MCP23017-E/SO/?ref=eda
X1 X2 X6 X7 = adafruit:SMACONNECTOR: SMA Connector 90° DIP SMA Connector, 50 Ohm (4UConnector: 07259)
X13 X14 X16 X18 = adafruit_power:ISO154X

## Net classes
0 default: width 0.406 mm, drill 0.102 mm, clearance 0.254 mm
1 Pump Out: width 0.508 mm, drill 0.102 mm, clearance 0.254 mm
2 12v: width 0.508 mm, drill 0.102 mm, clearance 0.254 mm
3 5v: width 0.457 mm, drill 0.102 mm, clearance 0.254 mm
4 3.3v: width 0.457 mm, drill 0.102 mm, clearance 0.254 mm
5 i2c: width 0.406 mm, drill 0.102 mm, clearance 0.254 mm
6 GPIO: width 0.406 mm, drill 0.102 mm, clearance 0.254 mm
8 New Class: drill 0.102 mm, clearance 0.152 mm